# Altium schematic sheet PLWD_MCU_IO.SchDoc
size A4; SheetNumber: 2; SheetTotal: 3
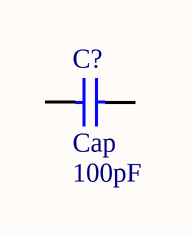
[diagram p0: PLWD_MCU_IO.SchDoc]

## Parts
C?  Cap  value 100pF  [RAD-0.3]

## Nets

Not connected (* = marked no-connect by the designer): C? 1 2

## Library data of the parts
C? = Cap: Capacitor; Published: 8-Jun-2000; LatestRevisionDate: 17-Jul-2002; LatestRevisionNote: Re-released for DXP Platform.; PackageReference: RAD-0.3; Publisher: Altium Limited; PackageDescription: Radial Cap, Thru-Hole; 2 Leads; 0.3 in Pin Spacing